# EAGLE design Callisto_LSOx10_v1p0 (EAGLE 9.6.2)
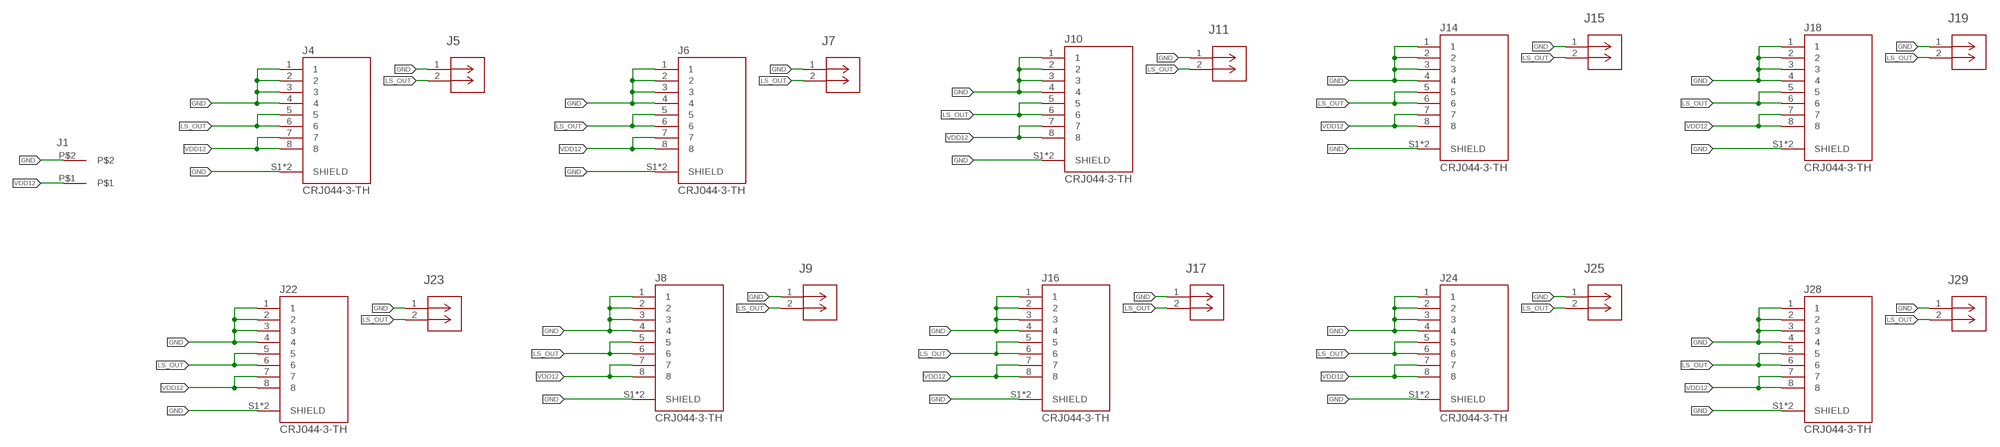
[diagram p0: schematic, sheet 1]

## Parts
J1  2-pos  3.81MM_1_X_2_RT_ANGLE_PLUG_HEADER  [2_3.81MM_PITCH]
J4  CRJ044-3-TH  [CUI_CRJ044-3-TH]
J5  CONN_530470210_PICOBLADE_X_2  [CON_530470210_MOL]
J6  CRJ044-3-TH  [CUI_CRJ044-3-TH]
J7  CONN_530470210_PICOBLADE_X_2  [CON_530470210_MOL]
J8  CRJ044-3-TH  [CUI_CRJ044-3-TH]
J9  CONN_530470210_PICOBLADE_X_2  [CON_530470210_MOL]
J10  CRJ044-3-TH  [CUI_CRJ044-3-TH]
J11  CONN_530470210_PICOBLADE_X_2  [CON_530470210_MOL]
J14  CRJ044-3-TH  [CUI_CRJ044-3-TH]
J15  CONN_530470210_PICOBLADE_X_2  [CON_530470210_MOL]
J16  CRJ044-3-TH  [CUI_CRJ044-3-TH]
J17  CONN_530470210_PICOBLADE_X_2  [CON_530470210_MOL]
J18  CRJ044-3-TH  [CUI_CRJ044-3-TH]
J19  CONN_530470210_PICOBLADE_X_2  [CON_530470210_MOL]
J22  CRJ044-3-TH  [CUI_CRJ044-3-TH]
J23  CONN_530470210_PICOBLADE_X_2  [CON_530470210_MOL]
J24  CRJ044-3-TH  [CUI_CRJ044-3-TH]
J25  CONN_530470210_PICOBLADE_X_2  [CON_530470210_MOL]
J28  CRJ044-3-TH  [CUI_CRJ044-3-TH]
J29  CONN_530470210_PICOBLADE_X_2  [CON_530470210_MOL]

## Nets
GND: J1.P$2 J4.1 J4.2 J4.3 J4.4 J4.S1(SHIELD) J4.S2(SHIELD) J5.1 J6.1 J6.2 J6.3 J6.4 J6.S1(SHIELD) J6.S2(SHIELD) J7.1 J8.1 J8.2 J8.3 J8.4 J8.S1(SHIELD) J8.S2(SHIELD) J9.1 J10.1 J10.2 J10.3 J10.4 J10.S1(SHIELD) J10.S2(SHIELD) J11.1 J14.1 J14.2 J14.3 J14.4 J14.S1(SHIELD) J14.S2(SHIELD) J15.1 J16.1 J16.2 J16.3 J16.4 J16.S1(SHIELD) J16.S2(SHIELD) J17.1 J18.1 J18.2 J18.3 J18.4 J18.S1(SHIELD) J18.S2(SHIELD) J19.1 J22.1 J22.2 J22.3 J22.4 J22.S1(SHIELD) J22.S2(SHIELD) J23.1 J24.1 J24.2 J24.3 J24.4 J24.S1(SHIELD) J24.S2(SHIELD) J25.1 J28.1 J28.2 J28.3 J28.4 J28.S1(SHIELD) J28.S2(SHIELD) J29.1
LS_OUT: J4.5 J4.6 J5.2 J6.5 J6.6 J7.2 J8.5 J8.6 J9.2 J10.5 J10.6 J11.2 J14.5 J14.6 J15.2 J16.5 J16.6 J17.2 J18.5 J18.6 J19.2 J22.5 J22.6 J23.2 J24.5 J24.6 J25.2 J28.5 J28.6 J29.2
VDD12: J1.P$1 J4.7 J4.8 J6.7 J6.8 J8.7 J8.8 J10.7 J10.8 J14.7 J14.8 J16.7 J16.8 J18.7 J18.8 J22.7 J22.8 J24.7 J24.8 J28.7 J28.8

## Library data of the parts
J1 = 3D_MIG_Controller:3.81MM_1_X_2_RT_ANGLE_PLUG_HEADER: TERM BLOCK HDR 2POS 90DEG 3.81MM; PARTNO: 691322310002
J4 J6 J8 J10 J14 J16 J18 J22 J24 J28 = 3D_MIG_Controller:CRJ044-3-TH: Modular Jack; MAXIMUM_PACKAGE_HEIGHT: 13.46 mm; PARTREV: 1.0; STANDARD: Manufacturer Recommendations
J5 J7 J9 J11 J15 J17 J19 J23 J25 J29 = 3D_MIG_Controller:CONN_530470210_PICOBLADE_X_2; COPYRIGHT: Copyright (C) 2022 Ultra Librarian. All rights reserved.; MANUFACTURER_PART_NUMBER: 530470210; MFR_NAME: Molex Connector Corporation

## Board
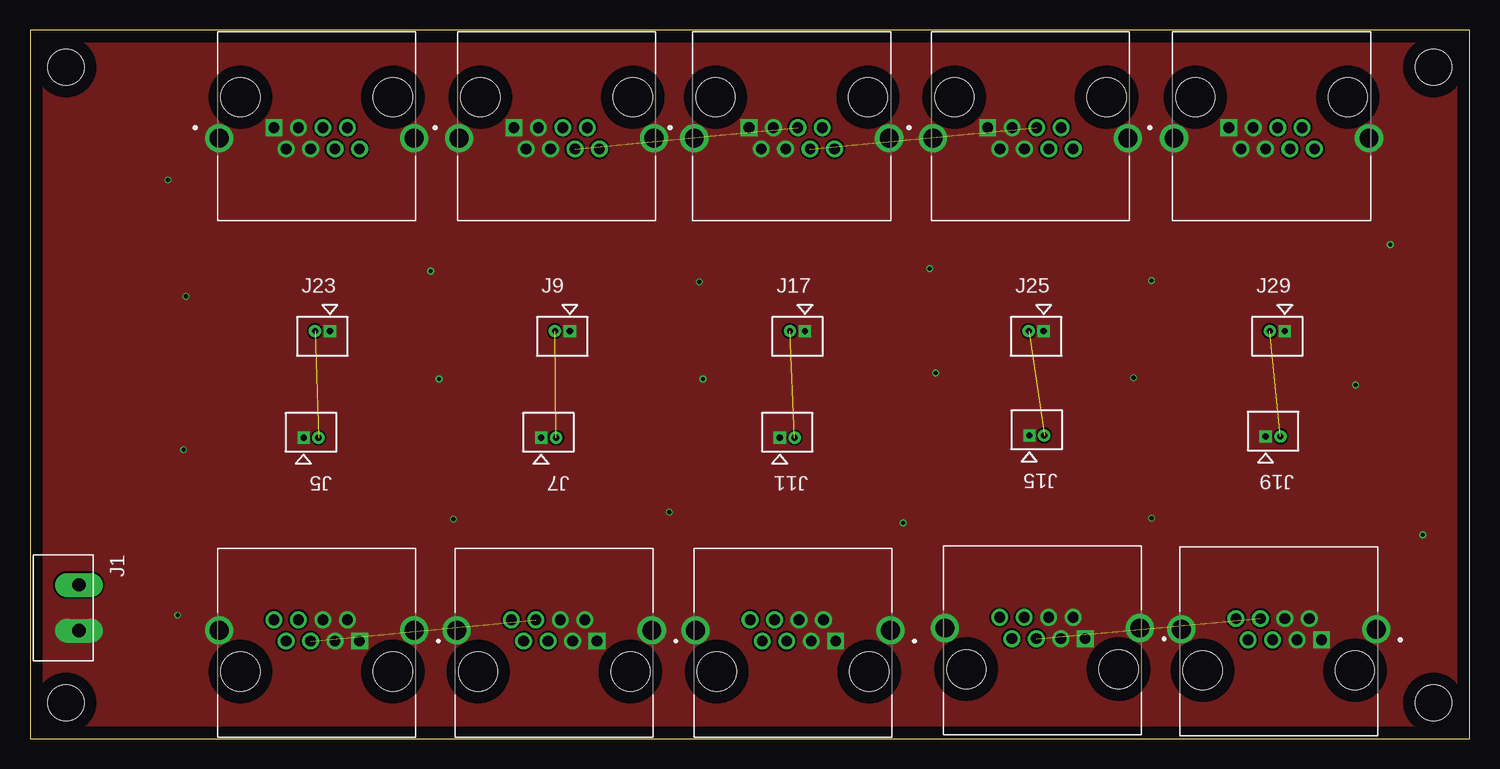
[diagram p1: board, top side]
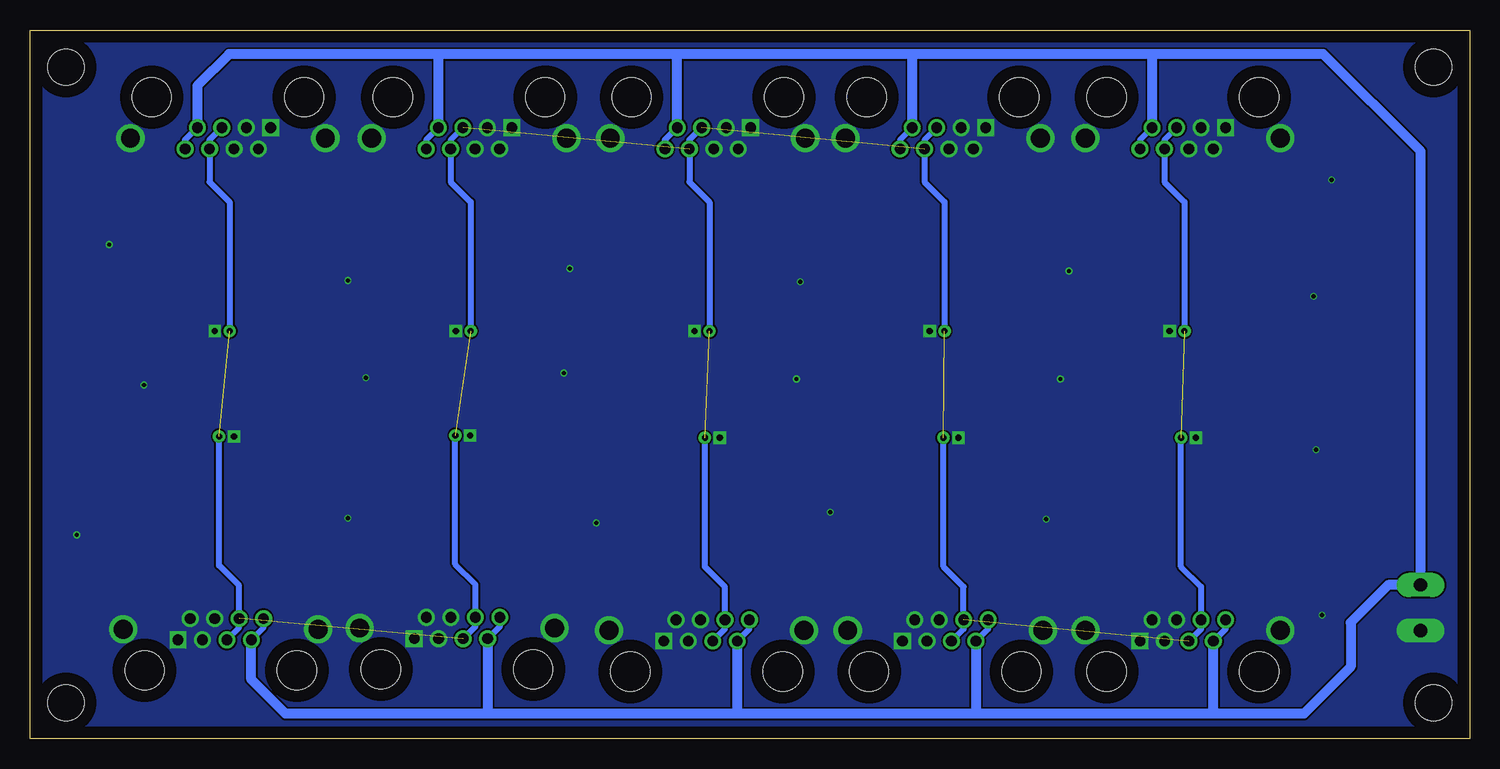
[diagram p2: board, bottom side, seen from below]

Size 120 x 59.1 mm. Coordinates in mm from the lower left corner, seen from the top.
Outline: 0,0 120,0 120,59.1 0,59.1 0,0
Copper layers (1*16): Top 0.035mm / dielectric 1.5mm / Bottom 0.035mm
Design rules "default": minimum track width 6mil, minimum drill 0.2mm, track to track 6mil, track to pad 6mil, pad to pad 6mil, via to via 6mil, smd to smd 6mil, copper to edge 40mil, drill to drill 6mil, minimum pad ring 10mil, minimum via ring 4mil, stop-mask expansion 4mil, vias tented up to drill 0mil, thermal gap 10mil
Holes 3 mm at 3,3 117,3 3,56 117,56

### Footprints (pad centres in the part's own frame; a part is rotated, then mirrored left to right if it is on the bottom)
2_3.81MM_PITCH = drill 1.1 pad 2 long: P$1 0,0; P$2 3.81,0
CUI_CRJ044-3-TH = drill 0.89 square: 1 3.57,2.54 | drill 0.89: 2 2.55,4.32; 3 1.53,2.54; 4 0.51,4.32; 5 -0.51,2.54; 6 -1.53,4.32; 7 -2.55,2.54; 8 -3.57,4.32 | drill 1.57: S1 8.13,3.43; S2 -8.13,3.43 | hole 3.25: -6.35,0; 6.35,0
CON_530470210_MOL = drill 0.508 pad 0.838 square: 1 0,0 | drill 0.508 pad 0.838: 2 -1.245,0

### Placement (x,y rotation side)
J1  4.08,12.82 270 top
J4  23.9,5.6 0 top
J5  22.8,25.1 180 top
J6  43.7,5.6 0 top
J7  42.6,25.1 180 top
J8  43.9,53.5 180 top
J9  45,34 0 top
J10  63.6,5.6 0 top
J11  62.5,25.1 180 top
J14  84.4,5.8 0 top
J15  83.3,25.3 180 top
J16  63.5,53.5 180 top
J17  64.6,34 0 top
J18  104.1,5.7 0 top
J19  103,25.2 180 top
J22  23.9,53.5 180 top
J23  25,34 0 top
J24  83.4,53.5 180 top
J25  84.5,34 0 top
J28  103.5,53.5 180 top
J29  104.6,34 0 top

### Tracks (layer width: path | path; a pad name or v marks a point on that pad's centre or on a via)
GND  (via drill 0.35)
  other vias: 12.3,10.3 35.3,18.3 53.3,18.9 72.8,18 75.5,30.5 56.1,30 34.1,30 12.8,24.1 13,36.9 33.4,39 55.8,38.1 75,39.2 93.5,18.4 92,30.1 93.5,38.2 116.1,17 110.5,29.5 113.4,41.2 11.5,46.6
  pour Bottom (no thermals): 0,59.1 120,59.1 120,0 0,0
  pour Top (no thermals): 0,59.1 120,59.1 120,0 0,0
LS_OUT  (9 unrouted)
  Bottom 0.508: J4.5 22.37,9.16 J4.6 22.37,12.67 24.05,14.35 J5.2 | J6.5 42.17,9.16 J6.6 42.17,12.67 43.84,14.35 J7.2 | J10.5 62.07,9.16 J10.6 62.07,12.67 63.74,14.35 J11.2 | J14.5 82.87,9.36 J14.6 82.87,12.87 84.55,14.54 J15.2 | J18.5 102.57,9.26 J18.6 102.57,12.77 104.25,14.45 J19.2 | J22.5 25.43,49.94 J22.6 25.43,46.43 23.75,44.76 J23.2 | J8.5 45.43,49.94 J8.6 45.43,46.43 43.76,44.76 J9.2 | J16.5 65.03,49.94 J16.6 65.03,46.43 63.35,44.76 J17.2 | J24.5 84.93,49.94 J24.6 84.93,46.43 83.25,44.76 J25.2 | J28.5 105.03,49.94 J28.6 105.03,46.43 103.36,44.76 J29.2
VDD12
  Bottom 0.508: J4.7 20.33,9.16 J4.8 20.33,9.95 | J6.7 40.13,9.16 J6.8 40.13,9.95 | J10.7 60.03,9.16 J10.8 60.03,9.95 | J14.7 80.83,9.36 J14.8 80.83,10.15 | J18.7 100.53,9.26 J18.8 100.53,10.05 | J22.7 27.47,49.94 J22.8 27.47,49.15 | J8.7 47.47,49.94 J8.8 47.47,49.15 | J16.7 67.07,49.94 J16.8 67.07,49.15 | J24.7 86.97,49.94 J24.8 86.97,49.15 | J28.7 107.07,49.94 J28.8 107.07,49.15
  Bottom 0.813: 21.1,2.1 41.1,2.1 | 41.1,2.1 61.1,2.1 | 61.1,2.1 81.9,2.1 | 81.9,2.1 98.7,2.1 101.55,4.95 J18.7 | 21.1,2.1 21.35,2.35 J4.7 | J6.7 41.15,2.15 41.1,2.1 | J10.7 61.05,2.15 61.1,2.1 | J14.7 81.85,2.15 81.9,2.1 | J28.7 106.06,54.45 103.4,57.1 86,57.1 | 26.3,57.1 12.2,57.1 4.08,48.98 J1.P$1 6.78,12.82 9.9,9.7 9.9,6 13.8,2.1 21.1,2.1 | 26.3,57.1 46.3,57.1 | 46.3,57.1 66,57.1 | 66,57.1 86,57.1 | J22.7 26.45,56.95 26.3,57.1 | J8.7 46.45,56.95 46.3,57.1 | J16.7 66.05,57.05 66,57.1 | J24.7 85.95,57.05 86,57.1